# EAGLE design Behavioural board V2 (EAGLE 9.6.2)
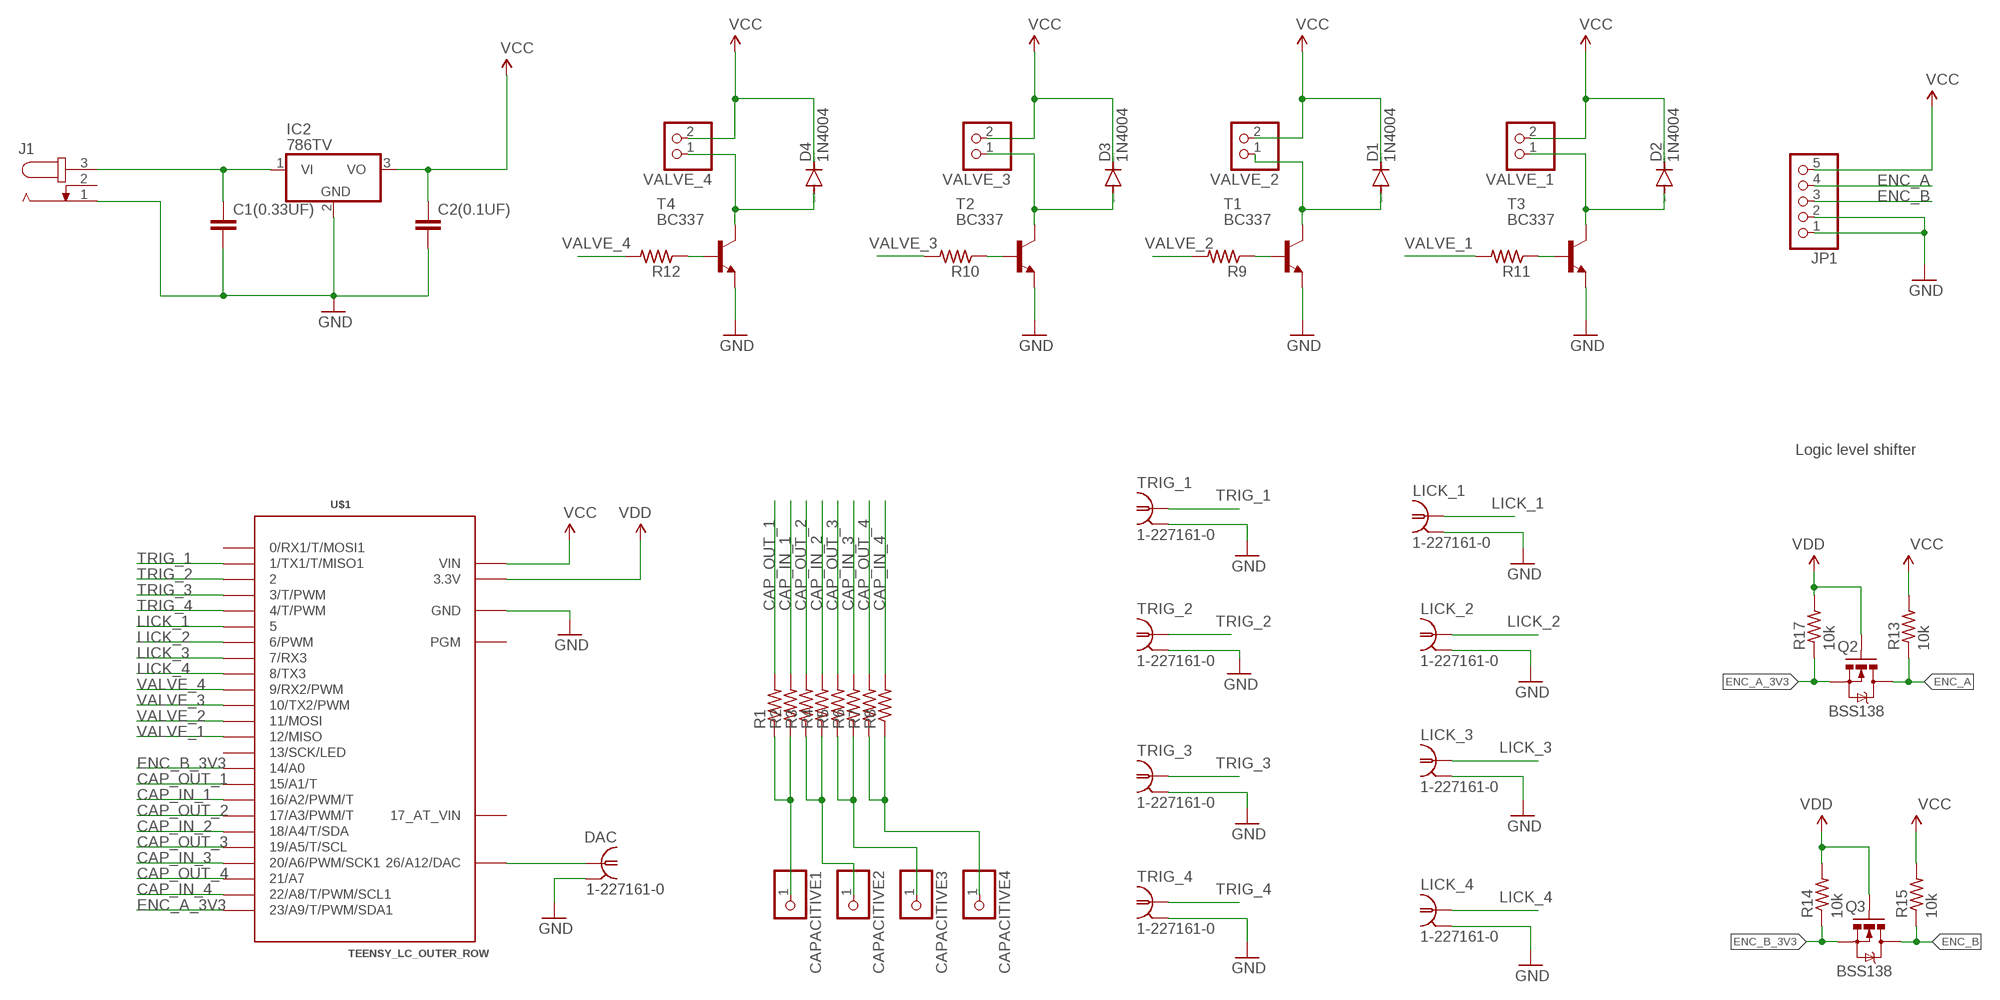
[diagram p0: schematic, sheet 1]

## Parts
C1(0.33UF)  C2.5/4  [C2.5-4]
C2(0.1UF)  C2.5/2  [C2.5-2]
CAPACITIVE1  PINHD-1X1  [1X01]
CAPACITIVE2  PINHD-1X1  [1X01]
CAPACITIVE3  PINHD-1X1  [1X01]
CAPACITIVE4  PINHD-1X1  [1X01]
D1  1N4004  [DO41-10]
D2  1N4004  [DO41-10]
D3  1N4004  [DO41-10]
D4  1N4004  [DO41-10]
DAC  1-227161-0  [AMP_227161]
IC2  786TV  [TO220V]
J1  JACK-PLUG0  [SPC4077]
JP1  PINHD-1X5  [1X05]
LICK_1  1-227161-0  [AMP_227161]
LICK_2  1-227161-0  [AMP_227161]
LICK_3  1-227161-0  [AMP_227161]
LICK_4  1-227161-0  [AMP_227161]
Q2  BSS138  MOSFET-NCHANNELSMD  [SOT23-3]
Q3  BSS138  MOSFET-NCHANNELSMD  [SOT23-3]
R1  R-US_0207/10  [0207/10]
R2  R-US_0207/10  [0207/10]
R3  R-US_0207/10  [0207/10]
R4  R-US_0207/10  [0207/10]
R5  R-US_0207/10  [0207/10]
R6  R-US_0207/10  [0207/10]
R7  R-US_0207/10  [0207/10]
R8  R-US_0207/10  [0207/10]
R9  R-US_0207/10  [0207/10]
R10  R-US_0207/10  [0207/10]
R11  R-US_0207/10  [0207/10]
R12  R-US_0207/10  [0207/10]
R13  10k  R-US_0207/10  [0207/10]
R14  10k  R-US_0207/10  [0207/10]
R15  10k  R-US_0207/10  [0207/10]
R17  10k  R-US_0207/10  [0207/10]
T1  BC337  [TO92]
T2  BC337  [TO92]
T3  BC337  [TO92]
T4  BC337  [TO92]
TRIG_1  1-227161-0  [AMP_227161]
TRIG_2  1-227161-0  [AMP_227161]
TRIG_3  1-227161-0  [AMP_227161]
TRIG_4  1-227161-0  [AMP_227161]
U$1  TEENSY_LC_OUTER_ROW  [TEENSY_3.0-3.2&LC_OUTER_ROW]
VALVE_1  PINHD-1X2  [1X02]
VALVE_2  PINHD-1X2  [1X02]
VALVE_3  PINHD-1X2  [1X02]
VALVE_4  PINHD-1X2  [1X02]

## Nets
12V: C1(0.33UF).1 IC2.1(VI) J1.3
CAP_IN_1: R2.2 U$1.16/A2(16/A2/PWM/T)
CAP_IN_2: R4.2 U$1.18/A4(18/A4/T/SDA)
CAP_IN_3: R6.2 U$1.20/A6(20/A6/PWM/SCK1)
CAP_IN_4: R8.2 U$1.22/A8(22/A8/T/PWM/SCL1)
CAP_OUT_1: R1.2 U$1.15/A1(15/A1/T)
CAP_OUT_2: R3.2 U$1.17/A3(17/A3/PWM/T)
CAP_OUT_3: R5.2 U$1.19/A5(19/A5/T/SCL)
CAP_OUT_4: R7.2 U$1.21/A7
ENC_A: JP1.4 Q2.3(D) R13.1
ENC_A_3V3: Q2.2(S) R17.1 U$1.23/A9(23/A9/T/PWM/SDA1)
ENC_B: JP1.3 Q3.3(D) R15.1
ENC_B_3V3: Q3.2(S) R14.1 U$1.14/A0
GND: C1(0.33UF).2 C2(0.1UF).2 DAC.2 IC2.2(GND) J1.1 JP1.1 JP1.2 LICK_1.2 LICK_2.2 LICK_3.2 LICK_4.2 T1.1(E) T2.1(E) T3.1(E) T4.1(E) TRIG_1.2 TRIG_2.2 TRIG_3.2 TRIG_4.2 U$1.AGND(GND) U$1.GND U$1.GND1(GND)
LICK_1: LICK_1.1 U$1.5
LICK_2: LICK_2.1 U$1.6(6/PWM)
LICK_3: LICK_3.1 U$1.7(7/RX3)
LICK_4: LICK_4.1 U$1.8(8/TX3)
N$1: DAC.1 U$1.RESET/DAC(26/A12/DAC)
N$20: CAPACITIVE1.1 R1.1 R2.1
N$21: CAPACITIVE2.1 R3.1 R4.1
N$22: CAPACITIVE3.1 R5.1 R6.1
N$23: CAPACITIVE4.1 R7.1 R8.1
N$24: R11.1 T3.2(B)
N$25: D2.A T3.3(C) VALVE_1.1
N$28: R9.1 T1.2(B)
N$29: D1.A T1.3(C) VALVE_2.1
N$31: R10.1 T2.2(B)
N$32: D3.A T2.3(C) VALVE_3.1
N$34: R12.1 T4.2(B)
N$35: D4.A T4.3(C) VALVE_4.1
TRIG_1: TRIG_1.1 U$1.1(1/TX1/T/MISO1)
TRIG_2: TRIG_2.1 U$1.2
TRIG_3: TRIG_3.1 U$1.3(3/T/PWM)
TRIG_4: TRIG_4.1 U$1.4(4/T/PWM)
VALVE_1: R11.2 U$1.12(12/MISO)
VALVE_2: R9.2 U$1.11(11/MOSI)
VALVE_3: R10.2 U$1.10(10/TX2/PWM)
VALVE_4: R12.2 U$1.9(9/RX2/PWM)
VCC: C2(0.1UF).1 D1.C D2.C D3.C D4.C IC2.3(VO) JP1.5 R13.2 R15.2 U$1.VIN VALVE_1.2 VALVE_2.2 VALVE_3.2 VALVE_4.2
VDD: Q2.1(G) Q3.1(G) R14.2 R17.2 U$1.3.3V U$1.3.3V1(3.3V)
Unconnected: J1.2 U$1.0(0/RX1/T/MOSI1) U$1.13(13/SCK/LED) U$1.PGM U$1.VBAT(17_AT_VIN)

## Notes on the sheet
- Logic level shifter

## Library data of the parts
C1(0.33UF) C2(0.1UF) = capacitor-wima:C: CAPACITOR naming: grid - package width
CAPACITIVE1-CAPACITIVE4 = pinhead:PINHD-1X1: PIN HEADER
D1-D4 = diode:1N4004: DIODE general purpose rectifier, 1 A
DAC LICK_1-LICK_4 TRIG_1-TRIG_4 = con-coax_xavi:?227161*: JACK, RIGHT ANGLE, 50 OHM, PCB, BNC Source: amp_227161.pdf; MF: TYCO ELECTRONICS; MPN: 1-227161; OC_FARNELL: unknown; OC_NEWARK: 33B3200
IC2 = linear:78*: Positive VOLTAGE REGULATOR Source: http://cache.national.com/ds/LM/LM78L05.pdf http://www.fairchildsemi.com/ds/LM/LM7805.pdf
J1 = con-jack:JACK-PLUG: DC POWER JACK Power Jack, DC, Right Angle, Through Hole, Rated 5A at 16VDC, PC Terminals Distributor: Farnell (www.Farnell.de) Drawing: 84N1161.pdf / 84N1162.pdf Manufacturer: SPC Technology (www.spctechnology.com) Type: SPC4077 / SPC 4078; OC_FARNELL: unknown; OC_NEWARK: unknown
JP1 = pinhead:PINHD-1X5: PIN HEADER
Q2 Q3 = SparkFun:MOSFET-NCHANNEL
R1-R15 R17 = rcl:R-US_: RESISTOR, American symbol; SPICEPREFIX: R
T1-T4 = transistor:BC337: NPN TRANSISTOR
U$1 = Teensy_3_and_LC_Series_Boards_v1.4:TEENSY_LC_OUTER_ROW: Teensy LC with only outer row of pins.
VALVE_1-VALVE_4 = pinhead:PINHD-1X2: PIN HEADER

## Net classes
0 default: width 0.203 mm, drill 0.406 mm, clearance 0.203 mm

## Board
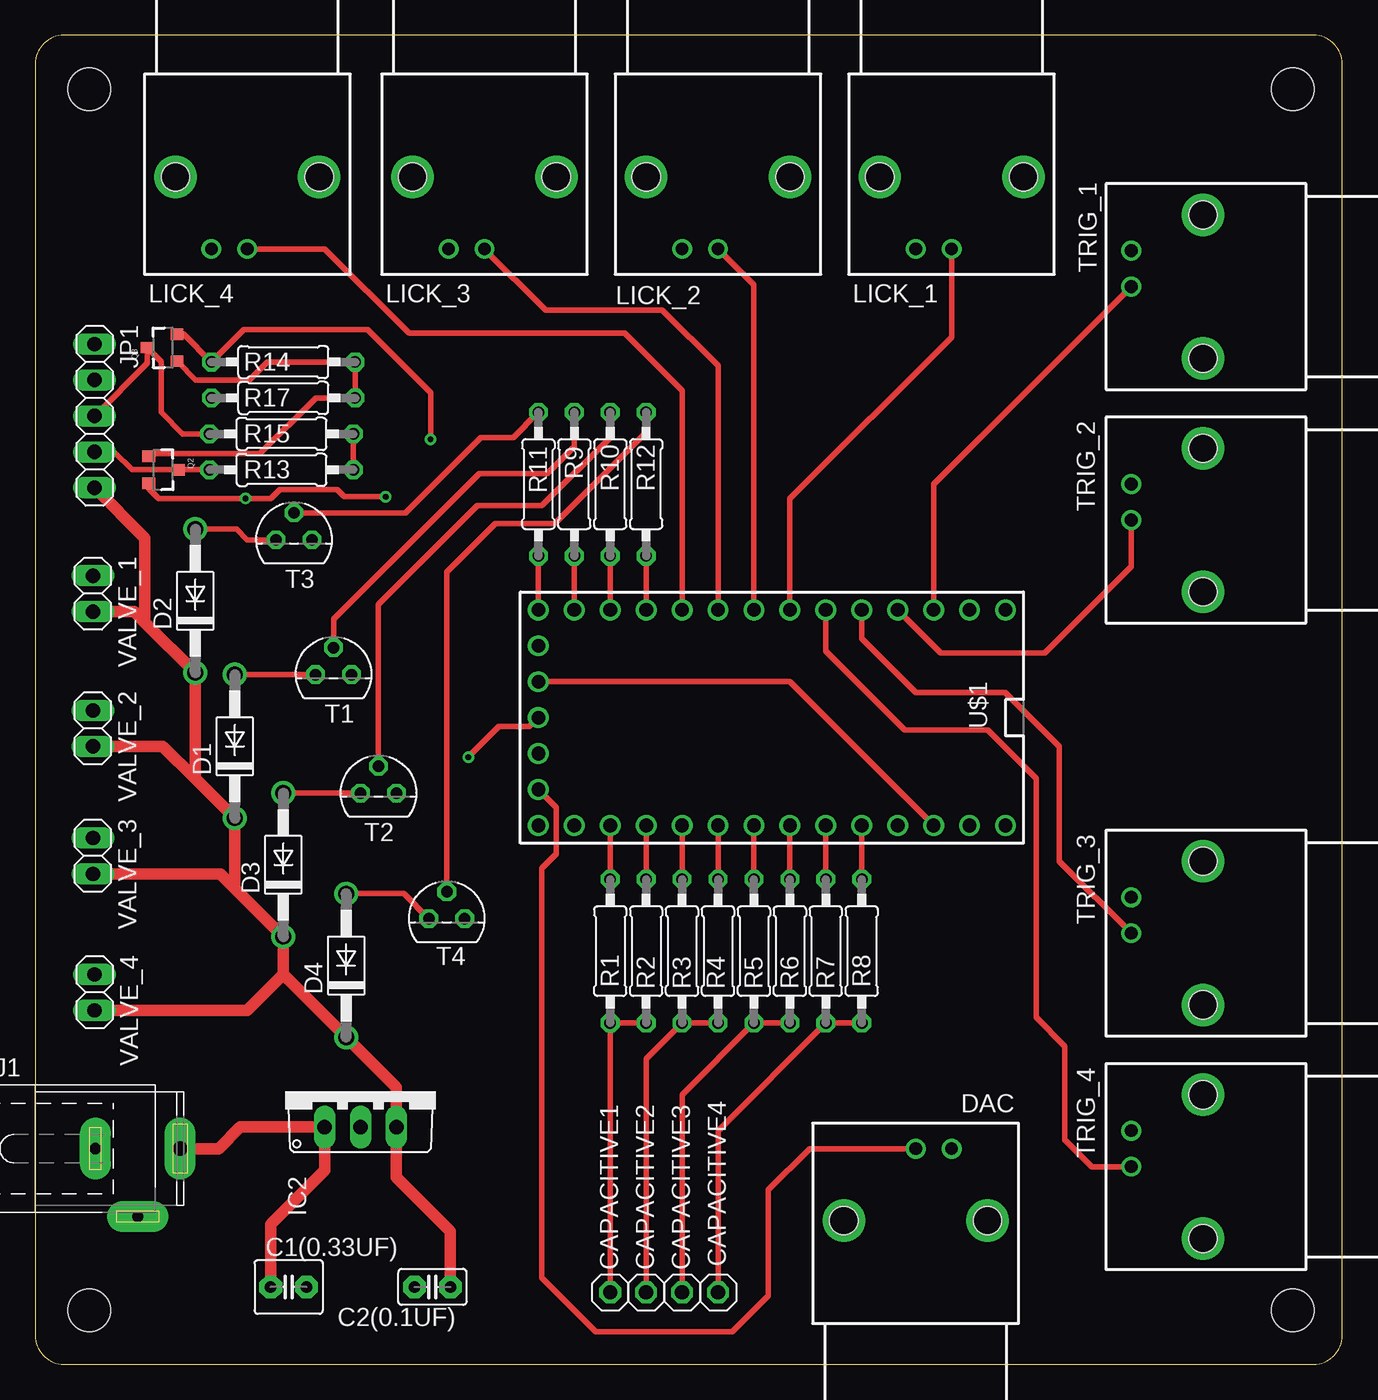
[diagram p1: board, top side]
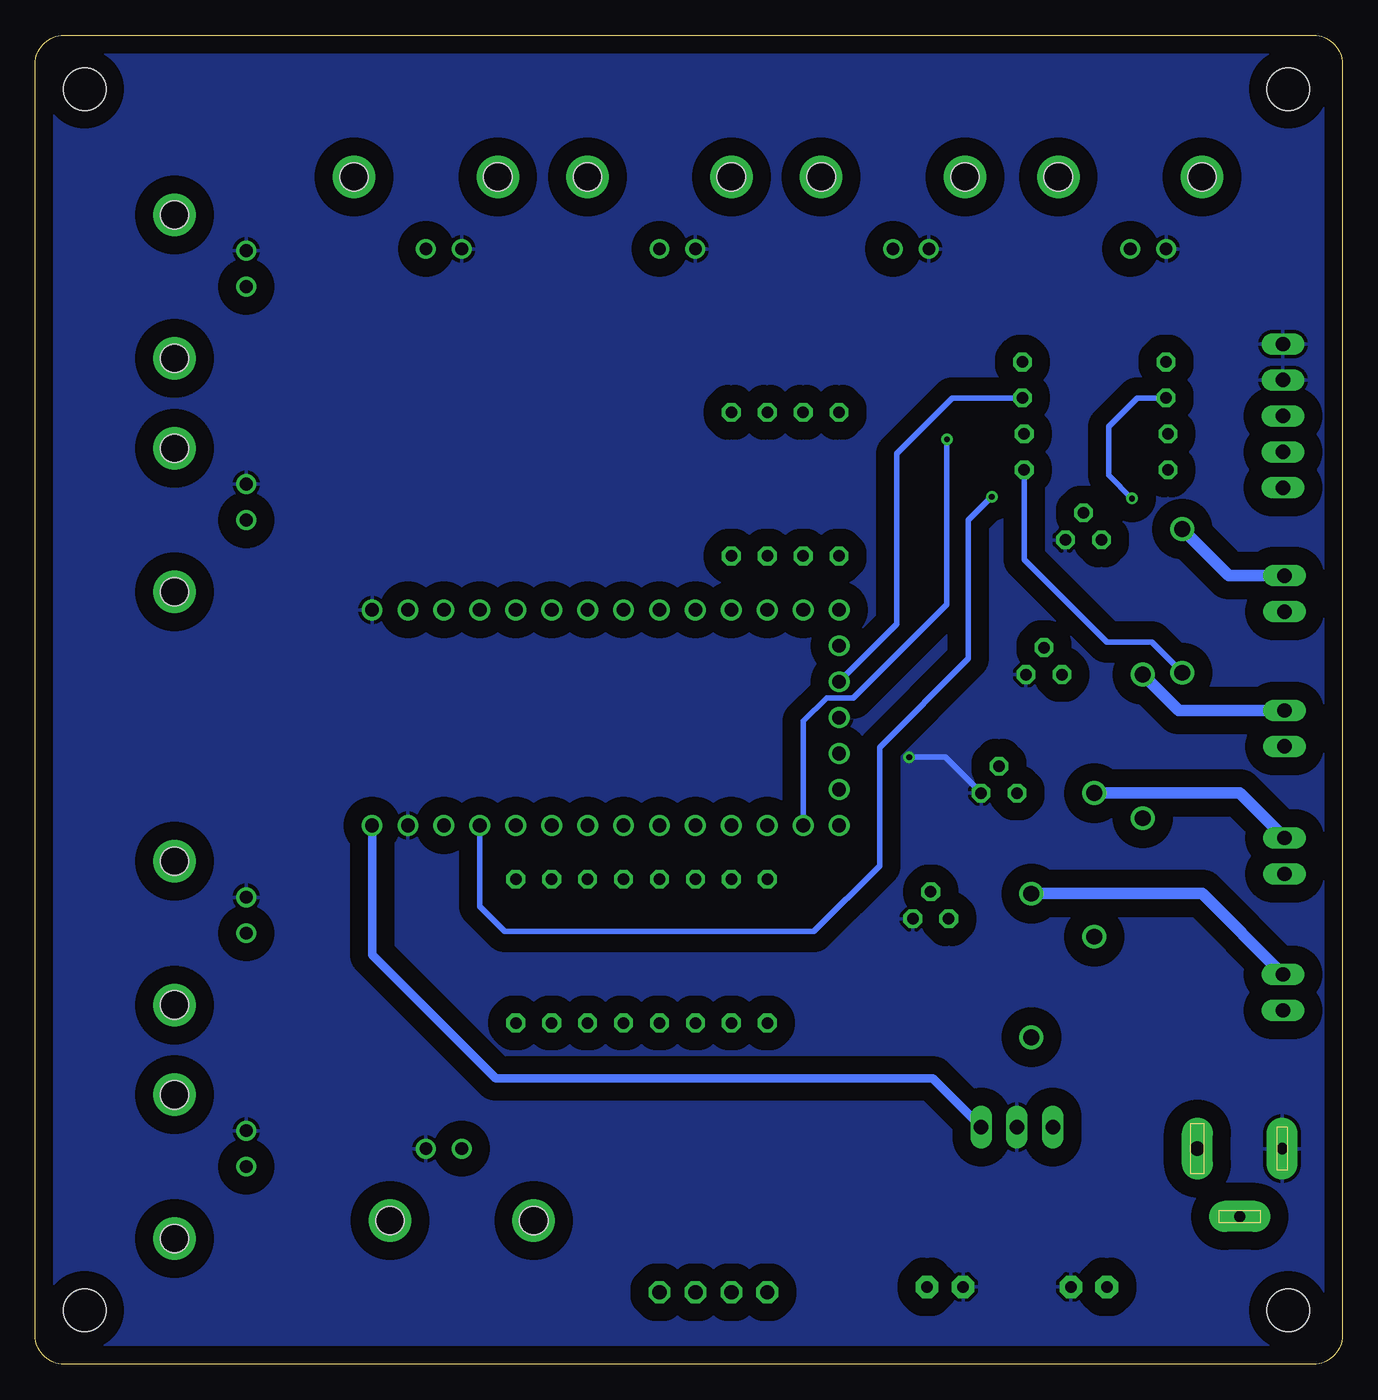
[diagram p2: board, bottom side, seen from below]

Size 92.38 x 93.97 mm. Coordinates in mm from the lower left corner, seen from the top.
Outline: 0,91.97 0,2 arc90 2,0 90.38,0 arc90 92.38,2 92.38,91.97 arc90 90.38,93.97 2,93.97 arc90 0,91.97
Copper layers (1*16): Top 0.035mm / dielectric 1.5mm / Bottom 0.035mm
Design rules "default": minimum track width 6mil, minimum drill 0.35mm, track to track 6mil, track to pad 6mil, pad to pad 6mil, via to via 6mil, smd to smd 6mil, copper to edge 40mil, drill to drill 6mil, minimum pad ring 10mil, minimum via ring 8mil, stop-mask expansion 4mil, vias tented up to drill 0mil, thermal gap 10mil
Holes 3 mm at 3.81,90.17 88.9,90.17 3.81,3.81 88.9,3.81

### Footprints (pad centres in the part's own frame; a part is rotated, then mirrored left to right if it is on the bottom)
C2.5-4 = drill 0.813 pad 1.6 octagon: 1 -1.27,0; 2 1.27,0
C2.5-2 = drill 0.813 pad 1.6 octagon: 1 -1.27,0; 2 1.27,0
1X01 = drill 1.016 octagon: 1 0,0
DO41-10 = drill 1.118: A 5.08,0; C -5.08,0
AMP_227161 = drill 0.9 pad 1.27: 1 0,-5.08; 2 -2.54,-5.08 | drill 2: P$1 -5.08,0; P$2 5.08,0 | hole 2: -5.08,0; 5.08,0
TO220V = drill 1.016 long: 1 -2.54,-2.54; 2 0,-2.54; 3 2.54,-2.54
SPC4077 = drill 0.8 pad 2.184 long: 1 -3,0; 2 0,-4.8 | drill 1 pad 2.184 long: 3 3,0
1X05 = drill 1.016 long: 1 -5.08,0; 2 -2.54,0; 3 0,0; 4 2.54,0; 5 5.08,0
SOT23-3 = smd 0.8 x 0.9: 1 -0.95,-1; 2 0.95,-1; 3 0,1.1
0207/10 = drill 0.813 octagon: 1 -5.08,0; 2 5.08,0
TO92 = drill 0.813 octagon: 1 1.27,0; 2 0,1.905; 3 -1.27,0
TEENSY_3.0-3.2&LC_OUTER_ROW = drill 0.965: 0 -7.62,13.97; 1 -7.62,11.43; 2 -7.62,8.89; 3 -7.62,6.35; 3.3V 7.62,11.43; 3.3V1 -2.54,-16.51; 4 -7.62,3.81; 5 -7.62,1.27; 6 -7.62,-1.27; 7 -7.62,-3.81; 8 -7.62,-6.35; 9 -7.62,-8.89; 10 -7.62,-11.43; 11 -7.62,-13.97; 12 -7.62,-16.51; 13 7.62,-16.51; 14/A0 7.62,-13.97; 15/A1 7.62,-11.43; 16/A2 7.62,-8.89; 17/A3 7.62,-6.35; 18/A4 7.62,-3.81; 19/A5 7.62,-1.27; 20/A6 7.62,1.27; 21/A7 7.62,3.81; 22/A8 7.62,6.35; 23/A9 7.62,8.89; AGND 7.62,13.97; GND -7.62,16.51; GND1 0,-16.51; PGM 2.54,-16.51; RESET/DAC 5.08,-16.51; VBAT -5.08,-16.51; VIN 7.62,16.51
1X02 = drill 1.016 long: 1 -1.27,0; 2 1.27,0

### Placement (x,y rotation side)
C1(0.33UF)  17.91,5.46 0 top
C2(0.1UF)  28.07,5.46 180 top
CAPACITIVE1  40.64,5.08 90 top
CAPACITIVE2  43.18,5.08 90 top
CAPACITIVE3  45.72,5.08 90 top
CAPACITIVE4  48.26,5.08 90 top
D1  14.1,43.69 90 top
D2  11.3,53.97 90 top
D3  17.53,35.31 90 top
D4  21.97,28.19 90 top
DAC  62.23,10.16 180 top
IC2  22.99,19.3 0 top
J1  7.24,15.24 0 top
JP1  4.19,67.06 270 top
LICK_1  64.77,83.95 0 top
LICK_2  48.26,83.95 0 top
LICK_3  31.75,83.95 0 top
LICK_4  14.99,83.95 0 top
Q2  9.02,63.25 270 top
Q3  9.02,71.88 90 top
R1  40.64,29.21 90 top
R2  43.18,29.21 90 top
R3  45.72,29.21 90 top
R4  48.26,29.21 90 top
R5  50.8,29.21 90 top
R6  53.34,29.21 90 top
R7  55.88,29.21 90 top
R8  58.42,29.21 90 top
R9  38.1,62.23 270 top
R10  40.64,62.23 270 top
R11  35.56,62.23 270 top
R12  43.18,62.23 270 top
R13  17.4,63.25 0 top
R14  17.53,70.87 0 top
R15  17.4,65.79 0 top
R17  17.53,68.33 0 top
T1  21.08,48.77 0 top
T2  24.26,40.39 0 top
T3  18.29,58.29 0 top
T4  29.08,31.5 0 top
TRIG_1  82.55,76.2 270 top
TRIG_2  82.55,59.69 270 top
TRIG_3  82.55,30.48 270 top
TRIG_4  82.55,13.97 270 top
U$1  52.07,45.72 270 top
VALVE_1  4.06,54.48 270 top
VALVE_2  4.06,44.96 270 top
VALVE_3  4.06,35.94 270 top
VALVE_4  4.19,26.29 270 top

### Tracks (layer width: path | path; a pad name or v marks a point on that pad's centre or on a via)
12V
  Top 0.813: J1.3 12.95,15.24 14.48,16.76 IC2.1 20.45,13.72 16.64,9.91 C1(0.33UF).1
CAP_IN_1
  Top 0.406: U$1.16/A2 R2.2
CAP_IN_2
  Top 0.406: U$1.18/A4 R4.2
CAP_IN_3
  Top 0.406: U$1.20/A6 R6.2
CAP_IN_4
  Top 0.406: R8.2 U$1.22/A8
CAP_OUT_1
  Top 0.406: R1.2 U$1.15/A1
CAP_OUT_2
  Top 0.406: U$1.17/A3 R3.2
CAP_OUT_3
  Top 0.406: U$1.19/A5 R5.2
CAP_OUT_4
  Top 0.406: U$1.21/A7 R7.2
ENC_A
  Top 0.406: JP1.4 5.59,64.52 6.86,63.25 Q2.3 R13.1
ENC_A_3V3  (via drill 0.41)
  Top 0.406: Q2.2 8.02,61.91 8.72,61.21 v14.86,61.21 16.64,61.21 17.27,61.85 21.34,61.85 21.84,61.34 v24.77,61.34
  Bottom 0.406: v14.86,61.21 16.51,62.87 16.51,66.29 14.48,68.33 R17.1 | v24.77,61.34 26.42,59.69 26.42,49.91 32.7,43.62 32.7,35.24 37.34,30.61 59.18,30.61 60.96,32.38 U$1.23/A9
ENC_B
  Top 0.406: JP1.3 7.92,70.78 Q3.3 8.89,70.91 8.89,67.31 10.41,65.79 R15.1
ENC_B_3V3  (via drill 0.41)
  Top 0.406: Q3.2 10.48,72.83 R14.1 14.73,73.15 23.5,73.15 27.94,68.71 v27.94,65.41
  Bottom 0.406: v27.94,65.41 27.94,53.72 34.54,47.12 36.45,47.12 38.1,45.47 U$1.14/A0
GND  (via drill 0.41)
  Top 0.406: v30.61,42.93 32.77,45.08 34.92,45.08 U$1.GND1
  Bottom 0.406: T2.1 28.07,42.93 v30.61,42.93
  pour Bottom (isolate 1.27): 0,95.25 94.23,95.25 94.23,-1.27 -1.27,-1.27 -1.27,93.98
LICK_1
  Top 0.406: LICK_1.1 64.77,72.64 53.34,61.21 U$1.5
LICK_2
  Top 0.406: LICK_2.1 50.8,76.33 U$1.6
LICK_3
  Top 0.406: LICK_3.1 36.07,74.55 44.32,74.55 48.26,70.61 U$1.7
LICK_4
  Top 0.406: LICK_4.1 20.45,78.87 26.42,72.9 41.66,72.9 45.72,68.83 U$1.8
N$1
  Top 0.406: DAC.1 54.74,15.24 51.82,12.32 51.82,4.83 49.28,2.29 39.62,2.29 35.81,6.1 35.81,35.05 36.83,36.07 36.83,39.37 U$1.RESET/DAC
N$20
  Top 0.406: R2.1 R1.1 CAPACITIVE1.1
N$21
  Top 0.406: R4.1 R3.1 43.18,21.59 CAPACITIVE2.1
N$22
  Top 0.406: R6.1 R5.1 45.72,19.05 CAPACITIVE3.1
N$23
  Top 0.406: R8.1 R7.1 48.26,16.51 CAPACITIVE4.1
N$24
  Top 0.406: R11.1 33.78,65.53 31.5,65.53 26.16,60.2 T3.2
N$25
  Top 0.406: D2.A 14.22,59.05 14.99,58.29 T3.3
  Bottom 0.813: D2.A 8,55.75 VALVE_1.1
N$28
  Top 0.406: R9.1 38.1,64.9 36.2,62.99 31.37,62.99 21.08,52.7 T1.2
N$29
  Top 0.406: D1.A T1.3
  Bottom 0.813: D1.A 11.56,46.23 VALVE_2.1
N$31
  Top 0.406: R10.1 40.64,65.53 35.81,60.71 31.24,60.71 24.26,53.72 T2.2
N$32
  Top 0.406: D3.A T2.3
  Bottom 0.813: D3.A 7.24,40.39 VALVE_3.1
N$34
  Top 0.406: R12.1 43.18,65.91 36.7,59.44 32.51,59.44 29.08,56.01 T4.2
N$35
  Top 0.406: D4.A 26.04,33.27 T4.3
  Bottom 0.813: D4.A 9.91,33.27 VALVE_4.1
TRIG_1
  Top 0.406: TRIG_1.1 63.5,62.23 U$1.1
TRIG_2
  Top 0.406: TRIG_2.1 77.47,56.39 71.37,50.29 64.01,50.29 U$1.2
TRIG_3
  Top 0.406: TRIG_3.1 72.39,35.56 72.39,43.69 68.58,47.5 62.23,47.5 58.42,51.31 U$1.3
TRIG_4
  Top 0.406: U$1.4 55.88,50.42 61.47,44.83 67.31,44.83 70.74,41.4 70.74,24.51 72.77,22.48 72.77,15.88 74.68,13.97 TRIG_4.1
VALVE_1
  Top 0.406: U$1.12 R11.2
VALVE_2
  Top 0.406: U$1.11 R9.2
VALVE_3
  Top 0.406: U$1.10 R10.2
VALVE_4
  Top 0.406: U$1.9 R12.2
VCC
  Top 0.406: R15.2 R13.2
  Top 0.813: C2(0.1UF).1 29.34,9.4 25.53,13.21 IC2.3 25.53,19.56 D4.C 17.53,27.56 | 17.53,27.56 D3.C 14.1,33.65 | 14.1,33.65 D1.C 11.3,41.4 | 11.3,41.4 D2.C 7.75,52.45 | 7.75,52.45 6.99,53.21 VALVE_1.2 | VALVE_2.2 9.02,43.69 11.3,41.4 | VALVE_3.2 13.08,34.67 14.1,33.65 | VALVE_4.2 14.99,25.02 17.53,27.56 | JP1.5 7.75,58.42 7.75,52.45
  Bottom 0.406: R13.2 22.48,56.9 16.64,51.05 13.46,51.05 D2.C
  Bottom 0.61: IC2.3 28.96,20.19 59.82,20.19 68.58,28.96 U$1.VIN
VDD
  Top 0.406: Q3.1 11.35,69.6 15.11,69.6 16.38,70.87 R14.2 R17.2 19.81,68.33 15.88,64.39 8.21,64.39 Q2.1 | U$1.3.3V1 53.34,48.26 U$1.3.3V
  Bottom 0.406: R17.2 27.56,68.33 31.5,64.39 31.5,52.32 U$1.3.3V1